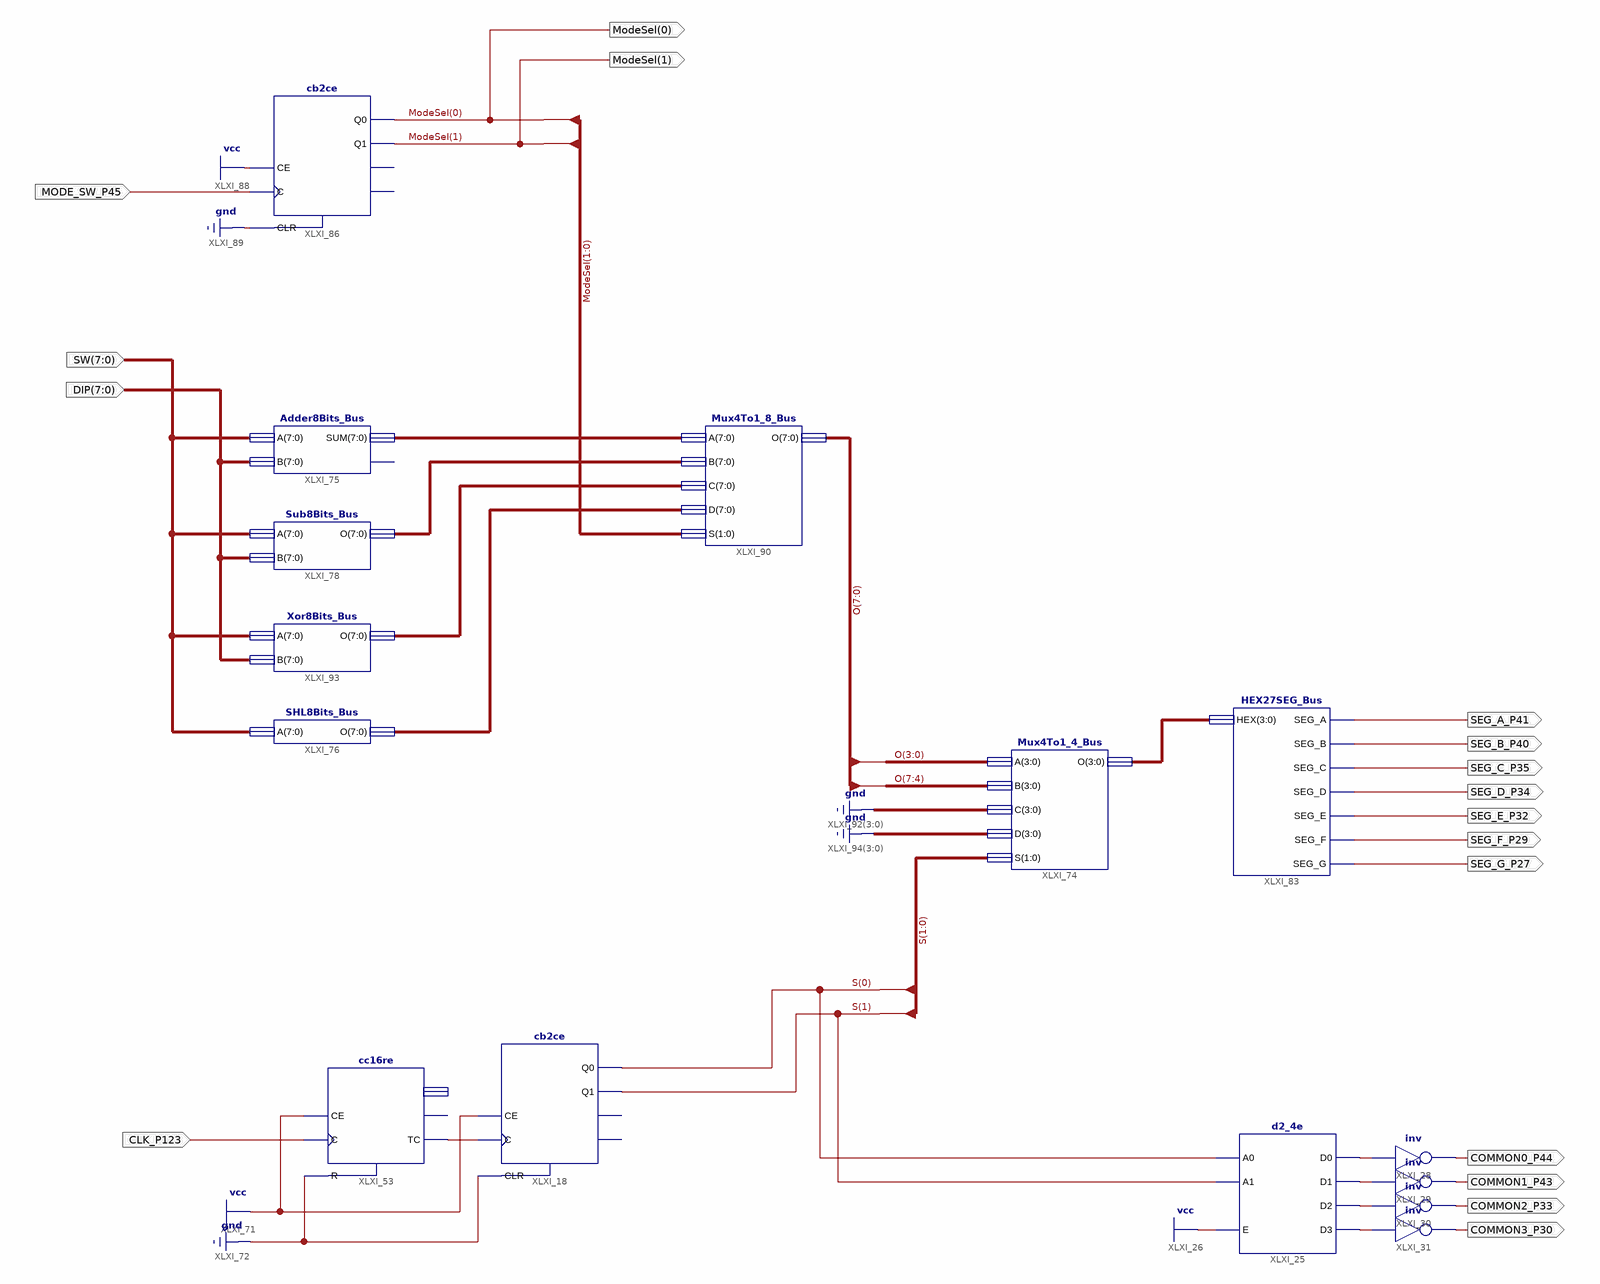
[diagram p0: schematic sheet 1]
// Xilinx ISE schematic MainCircuit.sch (spartan6) as structural Verilog: 15 symbols, 17 ports
module MainCircuit (
  input  CLK_P123,
  input  [7:0] SW,
  input  [7:0] DIP,
  input  MODE_SW_P45,
  output COMMON3_P30,
  output COMMON2_P33,
  output COMMON1_P43,
  output COMMON0_P44,
  output SEG_A_P41,
  output SEG_B_P40,
  output SEG_C_P35,
  output SEG_D_P34,
  output SEG_E_P32,
  output SEG_F_P29,
  output SEG_G_P27,
  output [1:0] ModeSel
);

  wire XLXN_98, XLXN_99, XLXN_100, XLXN_101, XLXN_151;
  wire [1:0] S;
  wire [3:0] XLXN_226;
  wire [7:0] O, XLXN_244, XLXN_245, XLXN_246, XLXN_247;

  d2_4e XLXI_25 (.A0(S[0]), .A1(S[1]), .E(1'b1), .D0(XLXN_98), .D1(XLXN_99), .D2(XLXN_100), .D3(XLXN_101));
  not XLXI_31 (COMMON3_P30, XLXN_101);
  not XLXI_30 (COMMON2_P33, XLXN_100);
  not XLXI_29 (COMMON1_P43, XLXN_99);
  not XLXI_28 (COMMON0_P44, XLXN_98);
  cb2ce XLXI_18 (.C(XLXN_151), .CE(1'b1), .CLR(1'b0), .Q0(S[0]), .Q1(S[1]));  // open: CEO, TC
  cc16re XLXI_53 (.C(CLK_P123), .CE(1'b1), .R(1'b0), .TC(XLXN_151));  // open: CEO, Q
  Mux4To1_4_Bus XLXI_74 (.O(XLXN_226), .A(O[3:0]), .B(O[7:4]), .C(4'b0000), .D(4'b0000), .S(S));
  Adder8Bits_Bus XLXI_75 (.A(SW), .B(DIP), .SUM(XLXN_244));  // open: C_OUT
  Sub8Bits_Bus XLXI_78 (.A(SW), .B(DIP), .O(XLXN_245));
  HEX27SEG_Bus XLXI_83 (
    .HEX(XLXN_226), .SEG_A(SEG_A_P41), .SEG_B(SEG_B_P40), .SEG_C(SEG_C_P35), .SEG_D(SEG_D_P34),
    .SEG_E(SEG_E_P32), .SEG_F(SEG_F_P29), .SEG_G(SEG_G_P27));
  cb2ce XLXI_86 (.C(MODE_SW_P45), .CE(1'b1), .CLR(1'b0), .Q0(ModeSel[0]), .Q1(ModeSel[1]));  // open: CEO, TC
  Mux4To1_8_Bus XLXI_90 (.O(O), .A(XLXN_244), .B(XLXN_245), .C(XLXN_246), .D(XLXN_247), .S(ModeSel));
  SHL8Bits_Bus XLXI_76 (.A(SW), .O(XLXN_247));
  Xor8Bits_Bus XLXI_93 (.A(SW), .B(DIP), .O(XLXN_246));
endmodule
